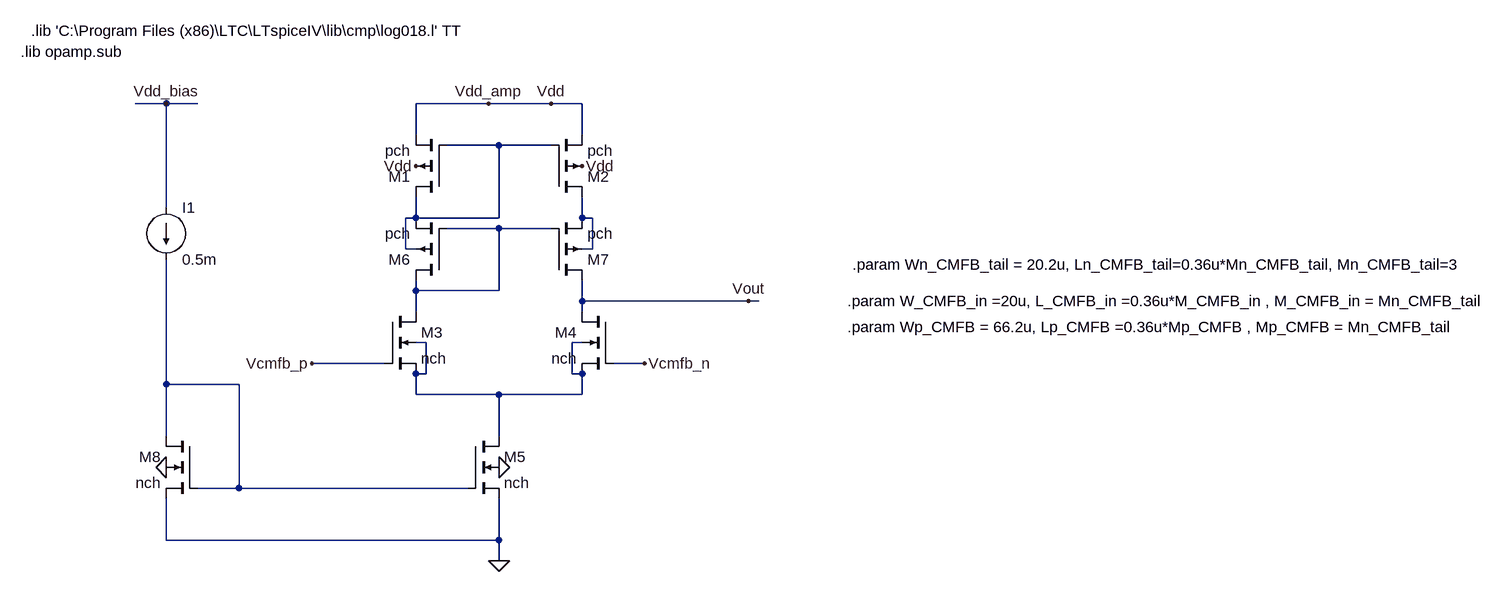
[diagram p0: schematic CMFB_Amplifier_comp_model.asc]
CMFB_Amplifier_comp_model.asc, the LTspice schematic file:
Version 4
SHEET 1 2296 852
WIRE -544 -272 -592 -272
WIRE -496 -272 -544 -272
WIRE -48 -272 -160 -272
WIRE 48 -272 -48 -272
WIRE 96 -272 48 -272
WIRE -160 -224 -160 -272
WIRE 96 -224 96 -272
WIRE -32 -208 -112 -208
WIRE 48 -208 -32 -208
WIRE -544 -112 -544 -272
WIRE -160 -96 -160 -128
WIRE -160 -96 -176 -96
WIRE -32 -96 -32 -208
WIRE -32 -96 -160 -96
WIRE 96 -96 96 -128
WIRE 112 -96 96 -96
WIRE -32 -80 -112 -80
WIRE 48 -80 -32 -80
WIRE -176 -48 -176 -96
WIRE -160 -48 -176 -48
WIRE 112 -48 112 -96
WIRE 112 -48 96 -48
WIRE -160 16 -160 0
WIRE -32 16 -32 -80
WIRE -32 16 -160 16
WIRE 96 32 96 0
WIRE 176 32 96 32
WIRE 352 32 176 32
WIRE 368 32 352 32
WIRE -160 48 -160 16
WIRE 96 48 96 32
WIRE -144 96 -160 96
WIRE 96 96 80 96
WIRE -208 128 -320 128
WIRE 192 128 144 128
WIRE -144 144 -144 96
WIRE -144 144 -160 144
WIRE 80 144 80 96
WIRE 96 144 80 144
WIRE -544 160 -544 -32
WIRE -432 160 -544 160
WIRE -160 176 -160 144
WIRE -32 176 -160 176
WIRE 96 176 96 144
WIRE 96 176 -32 176
WIRE -544 240 -544 160
WIRE -32 240 -32 176
WIRE -432 320 -432 160
WIRE -432 320 -496 320
WIRE -320 320 -432 320
WIRE -80 320 -320 320
WIRE -544 400 -544 336
WIRE -32 400 -32 336
WIRE -32 400 -544 400
WIRE -32 432 -32 400
FLAG -160 -176 Vdd
FLAG 96 -176 Vdd
FLAG -32 432 0
FLAG -32 288 0
FLAG -544 288 0
FLAG -48 -272 Vdd_amp
FLAG 352 32 Vout
FLAG -320 128 Vcmfb_p
FLAG 192 128 Vcmfb_n
FLAG -544 -272 Vdd_bias
FLAG 48 -272 Vdd
DATAFLAG -32 176 "round($*1000)/1000"
DATAFLAG 16 224 "round(Id(M23)*100000000)/100000000"
DATAFLAG -320 320 ""
DATAFLAG 176 32 "round($*1000)/1000"
DATAFLAG -32 -208 "round($*1000)/1000"
DATAFLAG 144 -96 "round(-Id(x6:x5:M2)*100000000)/100000000"
DATAFLAG -96 224 "round(Id(x6:x5:M5)*100000000)/100000000"
DATAFLAG -224 -112 "round(-Id(x6:x5:M1)*100000000)/100000000"
DATAFLAG -32 -80 "round($*1000)/1000"
SYMBOL pmos4 -112 -128 R180
SYMATTR InstName M1
SYMATTR Value pch
SYMATTR Value2 l={Lp_CMFB} w={Wp_CMFB} m={Mp_CMFB}
SYMBOL pmos4 48 -128 M180
SYMATTR InstName M2
SYMATTR Value pch
SYMATTR Value2 l={Lp_CMFB} w={Wp_CMFB} m={Mp_CMFB}
SYMBOL nmos4 -208 48 R0
SYMATTR InstName M3
SYMATTR Value nch
SYMATTR Value2 l={L_CMFB_in} w={W_CMFB_in} m={M_CMFB_in}
SYMBOL nmos4 144 48 M0
SYMATTR InstName M4
SYMATTR Value nch
SYMATTR Value2 l={L_CMFB_in} w={W_CMFB_in} m={M_CMFB_in}
SYMBOL nmos4 -80 240 R0
SYMATTR InstName M5
SYMATTR Value nch
SYMATTR Value2 l={Ln_CMFB_tail} w={Wn_CMFB_tail} m={Mn_CMFB_tail}
SYMBOL current -544 -112 R0
WINDOW 123 0 0 Left 2
WINDOW 39 0 0 Left 2
SYMATTR InstName I1
SYMATTR Value 0.5m
SYMBOL nmos4 -496 240 M0
SYMATTR InstName M8
SYMATTR Value nch
SYMATTR Value2 l={Ln_CMFB_tail} w={Wn_CMFB_tail} m={Mn_CMFB_tail}
SYMBOL pmos4 -112 0 R180
SYMATTR InstName M6
SYMATTR Value pch
SYMATTR Value2 l={Lp_CMFB} w={Wp_CMFB} m={Mp_CMFB}
SYMBOL pmos4 48 0 M180
SYMATTR InstName M7
SYMATTR Value pch
SYMATTR Value2 l={Lp_CMFB} w={Wp_CMFB} m={Mp_CMFB}
TEXT -752 -384 Left 2 !.lib 'C:\\Program Files (x86)\\LTC\\LTspiceIV\\lib\\cmp\\log018.l' TT
TEXT -768 -352 Left 2 !.lib opamp.sub
TEXT 512 -24 Left 2 !.param Wn_CMFB_tail = 20.2u, Ln_CMFB_tail=0.36u*Mn_CMFB_tail, Mn_CMFB_tail=3
TEXT 504 72 Left 2 !.param Wp_CMFB = 66.2u, Lp_CMFB =0.36u*Mp_CMFB , Mp_CMFB = Mn_CMFB_tail
TEXT 504 32 Left 2 !.param W_CMFB_in =20u, L_CMFB_in =0.36u*M_CMFB_in , M_CMFB_in = Mn_CMFB_tail

The netlist it stands for:
* CMFB_Amplifier_comp_model.asc
M1 N001 N001 Vdd_amp Vdd_amp pch l={Lp_CMFB} w={Wp_CMFB} m={Mp_CMFB}
M2 N002 N001 Vdd_amp Vdd_amp pch l={Lp_CMFB} w={Wp_CMFB} m={Mp_CMFB}
M3 N003 Vcmfb_p N004 N004 nch l={L_CMFB_in} w={W_CMFB_in} m={M_CMFB_in}
M4 Vout Vcmfb_n N004 N004 nch l={L_CMFB_in} w={W_CMFB_in} m={M_CMFB_in}
M5 N004 N005 0 0 nch l={Ln_CMFB_tail} w={Wn_CMFB_tail} m={Mn_CMFB_tail}
I1 Vdd_bias N005 0.5m
M8 N005 N005 0 0 nch l={Ln_CMFB_tail} w={Wn_CMFB_tail} m={Mn_CMFB_tail}
M6 N003 N003 N001 N001 pch l={Lp_CMFB} w={Wp_CMFB} m={Mp_CMFB}
M7 Vout N003 N002 N002 pch l={Lp_CMFB} w={Wp_CMFB} m={Mp_CMFB}
.model NMOS NMOS
.model PMOS PMOS
.lib standard.mos
.lib 'C:\Program Files (x86)\LTC\LTspiceIV\lib\cmp\log018.l' TT
.lib opamp.sub
.param Wn_CMFB_tail = 20.2u, Ln_CMFB_tail=0.36u*Mn_CMFB_tail, Mn_CMFB_tail=3
.param Wp_CMFB = 66.2u, Lp_CMFB =0.36u*Mp_CMFB , Mp_CMFB = Mn_CMFB_tail
.param W_CMFB_in =20u, L_CMFB_in =0.36u*M_CMFB_in , M_CMFB_in = Mn_CMFB_tail
.backanno
.end